# EasyEDA Pro project ProProject_2024电赛备赛清单_Wang01_2024-08-05.epro, schematic Schematic6
Create Date: 2024-07-20; Page Name: P1; Project Name: 2024电赛备赛清单_Wang01; Schematic Name: Schematic6; Update Date: 2024-07-20; Company: 嘉立创EDA; Page Size: A4; Version: V1.0
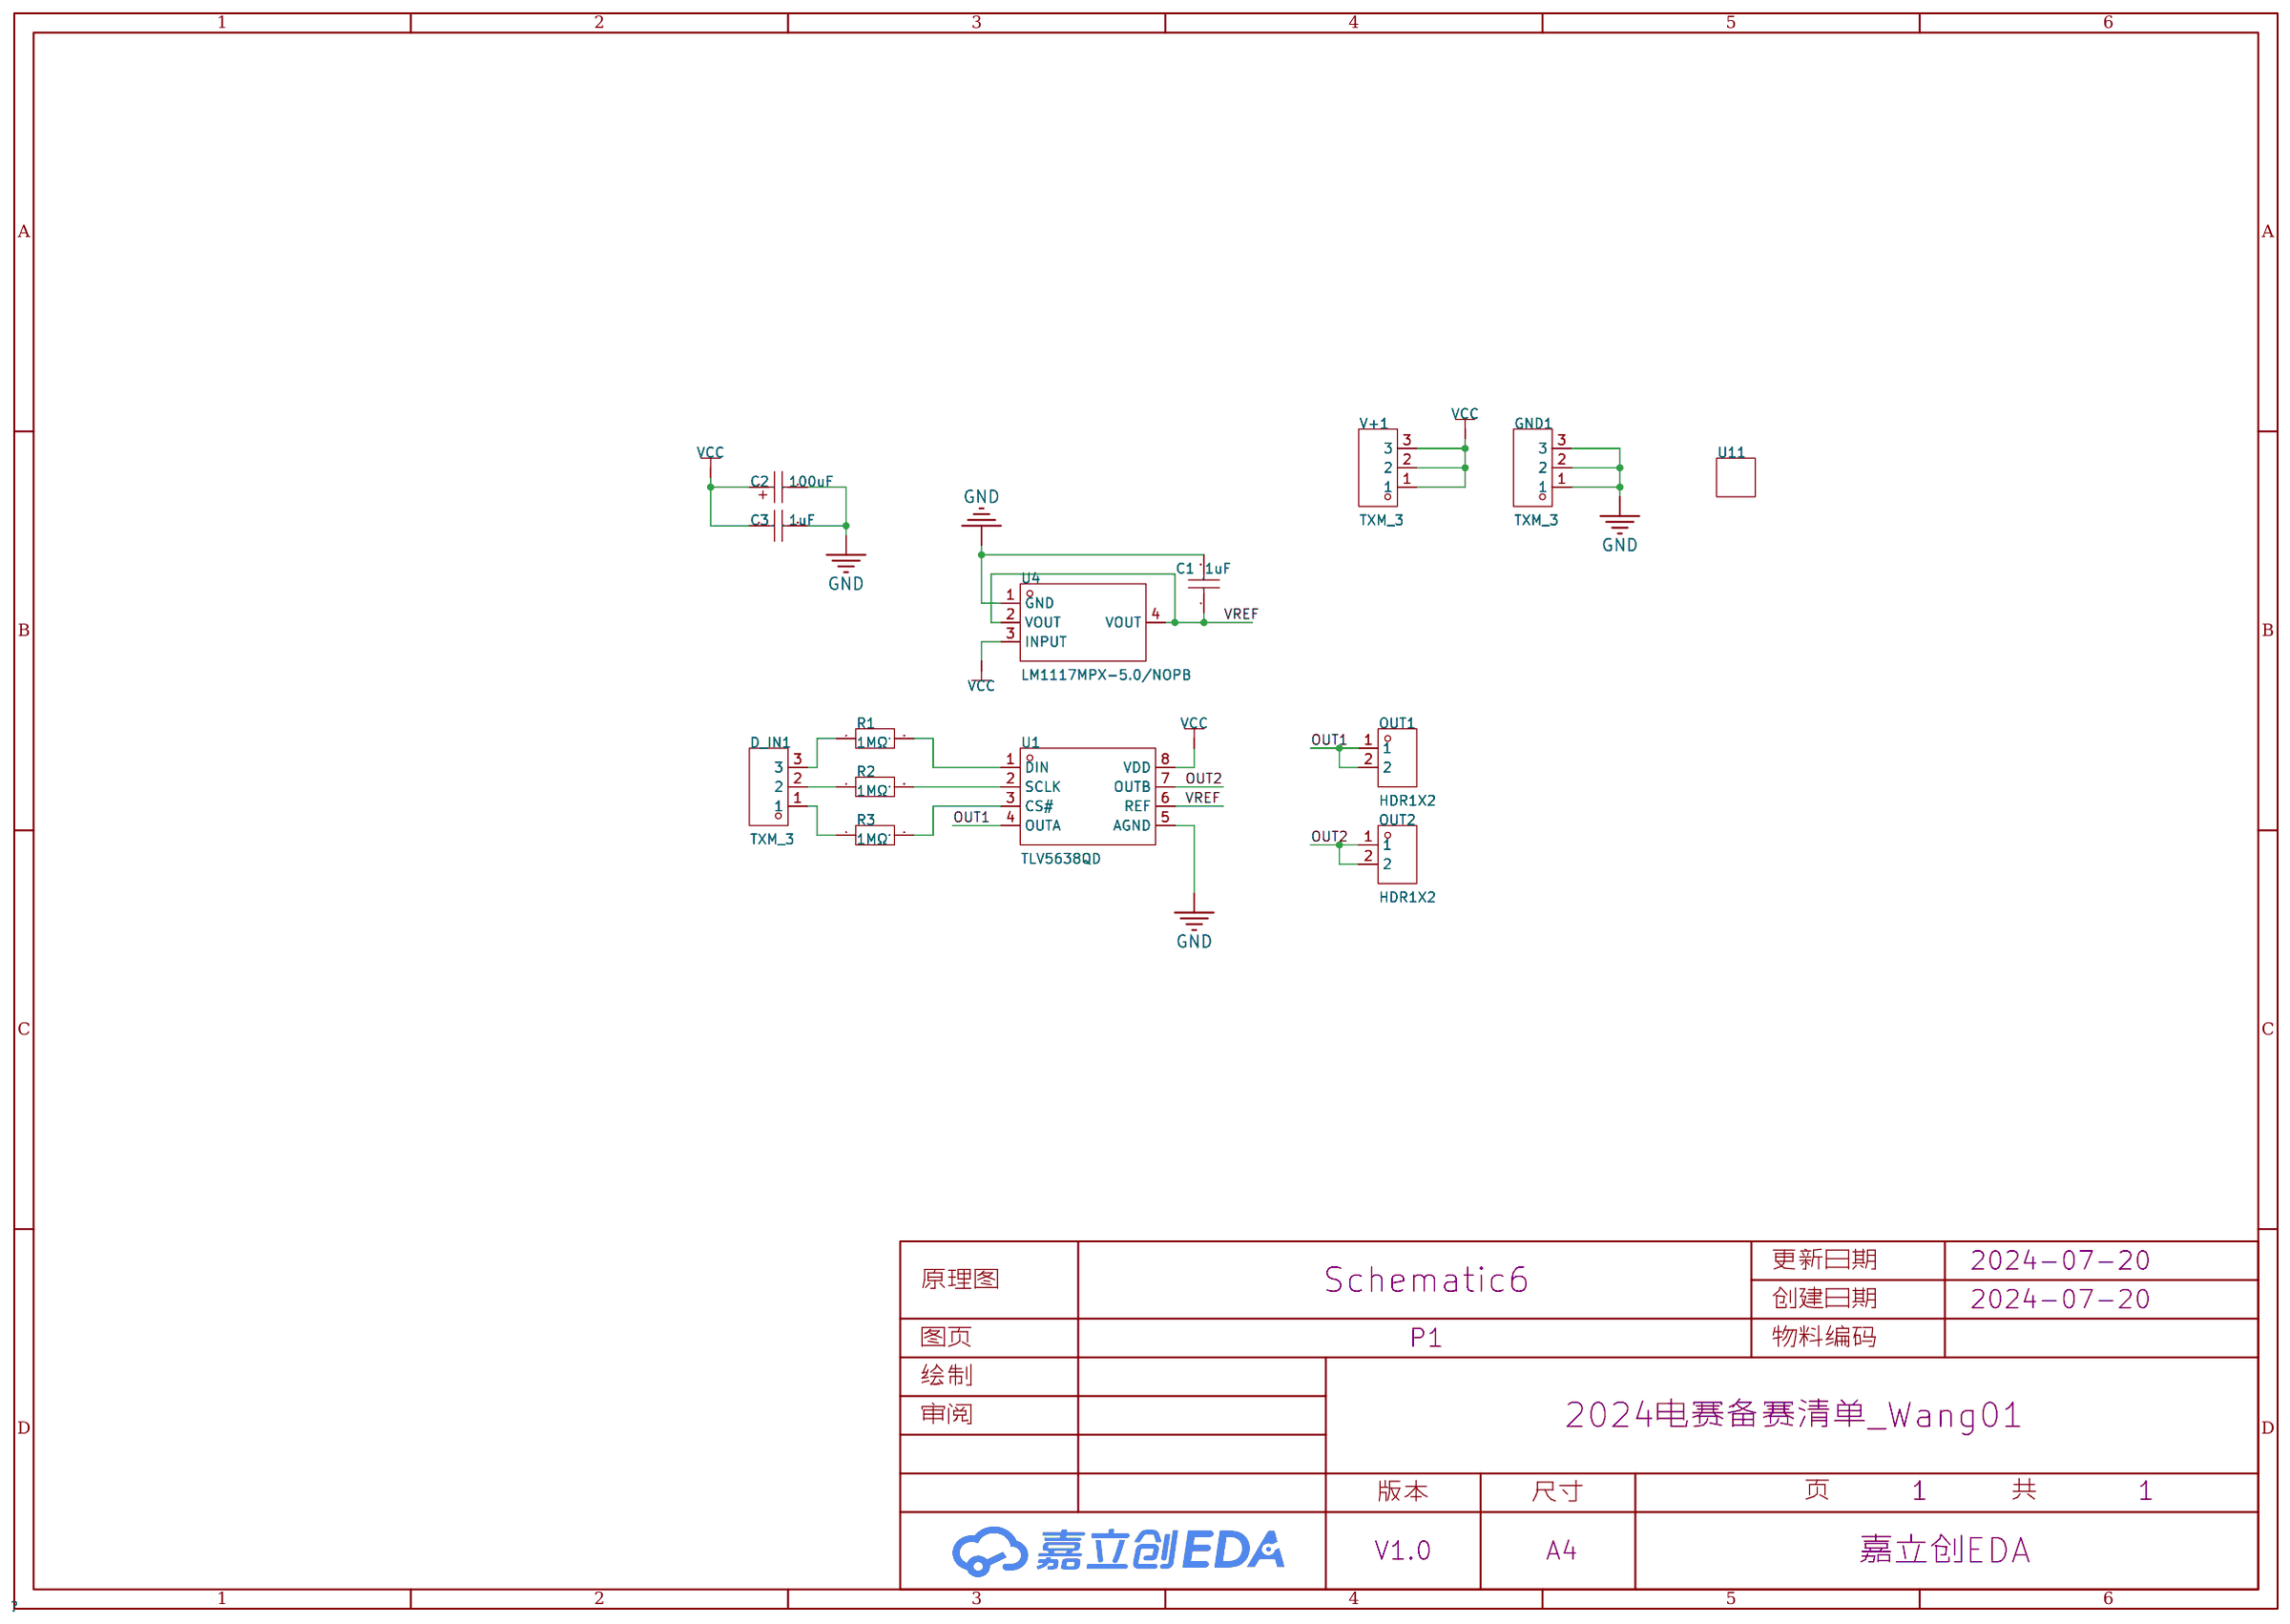
[diagram p1: schematic sheet]

## Parts
C1  1uF  [C0805]
C2  100uF  [CASE-B_3528]
C3  1uF  [C0805]
D_IN1  TXM_3  [HDR-TH_3P-P2.54-V-M-A]
GND1  TXM_3  [HDR-TH_3P-P2.54-V-M-A]
OUT1  HDR1X2  [HDR-TH_2P-P2.54-V-M-1]
OUT2  HDR1X2  [HDR-TH_2P-P2.54-V-M-1]
R1  1MΩ  [R0805]
R2  1MΩ  [R0805]
R3  1MΩ  [R0805]
U1  TLV5638QD  [SOIC-8_L4.9-W3.9-P1.27-LS6.0-BL]
U4  LM1117MPX-5.0/NOPB  [SOT-223-4_L6.5-W3.5-P2.30-LS7.0-BR]
U11  -  [丝印logo_UMR]
V+1  TXM_3  [HDR-TH_3P-P2.54-V-M-A]

## Library data of the parts
C1 C3 = CL21B105KBFNNNE: 容值:1uF;精度:±10%;额定电压:50V;材质(温度系数):X7R;; LCSC Part Name: 1uF ±10% 50V; Supplier Part: C28323; Manufacturer: SAMSUNG(三星); Supplier Footprint: 0805; JLCPCB Part Class: Basic Part; Datasheet: https://atta.szlcsc.com/upload/public/pdf/source/20160103/1457707718219.pdf; Supplier: LCSC; Tolerance: ±10%; Voltage Rated: 50V; Temperature Coefficient: X7R
C2 = TAJB107K006RNJ: 容值:100uF;精度:±10%;额定电压:6.3V;等效串联电阻:1.7Ω@100kHz;工作温度:-55℃~+125℃;; LCSC Part Name: 100uF ±10% 6.3V; Supplier Part: C16133; Manufacturer: Kyocera AVX; JLCPCB Part Class: Basic Part; Datasheet: https://atta.szlcsc.com/upload/public/pdf/source/20160107/1457707750344.pdf; Supplier: LCSC; Tolerance: ±10%; Rated Voltage: 6.3V; Equivalent Series Resistance(ESR): 1.7Ω@100kHz; Operating Temperature: -55℃~+125℃
D_IN1 GND1 V+1 = TXM_3: Supplier Part: C9900014923; Supplier Footprint: 排针; JLCPCB Part Class: Extended Part; Datasheet: https://atta.szlcsc.comnull; Supplier: LCSC
OUT1 OUT2 = HDR1X2: Supplier Part: C9900014921; Supplier Footprint: 排针; JLCPCB Part Class: Extended Part; Supplier: LCSC
R1-R3 = HVC0805T1004JET: 电阻类型:厚膜电阻;阻值:1MΩ;精度:±5%;功率:125mW;; LCSC Part Name: 厚膜电阻 1MΩ ±5% 125mW; Supplier Part: C4322748; Manufacturer: Ohmite; Supplier Footprint: 0805; Supplier: LCSC; Type: 厚膜电阻; Tolerance: ±5%; Power(Watts): 125mW; Temperature Coefficient: ±100ppm/℃; Operating Temperature Range: -55℃~+155℃
U1 = TLV5638QD: Supplier Part: C1554753; Manufacturer: TI(德州仪器); Supplier Footprint: SOIC-8; JLCPCB Part Class: Extended Part; Datasheet: https://atta.szlcsc.com/upload/public/pdf/source/20230221/7D25853FC73EB2D2A8A7EF60180EEA7B.pdf; Supplier: LCSC
U4 = LM1117MPX-5.0/NOPB_C730069: 输出类型:-;; Supplier Part: C730069; Manufacturer: TI(德州仪器); Supplier Footprint: SOT-223-4; JLCPCB Part Class: Extended Part; Supplier: LCSC
U11 = 丝印_UMR

## Nets
GND: C1.2 C2.2 C3.2 GND1.1 GND1.2 GND1.3 U1.5(AGND) U4.1(GND)
VCC: C2.1 C3.1 U1.8(VDD) U4.3(INPUT) V+1.1 V+1.2 V+1.3
OUT1: OUT1.1 OUT1.2 U1.4(OUTA)
OUT2: OUT2.1 OUT2.2 U1.7(OUTB)
VREF: C1.1 U1.6(REF) U4.2(VOUT) U4.4(VOUT)
$1N885: D_IN1.2 R2.1
$1N888: D_IN1.3 R1.1
$1N892: D_IN1.1 R3.1
$1N896: R3.2 U1.3(CS#)
$1N901: R2.2 U1.2(SCLK)
$1N904: R1.2 U1.1(DIN)
